# Altium schematic sheet band.SchDoc: Band
size A3; SheetNumber: 1; SheetTotal: 1
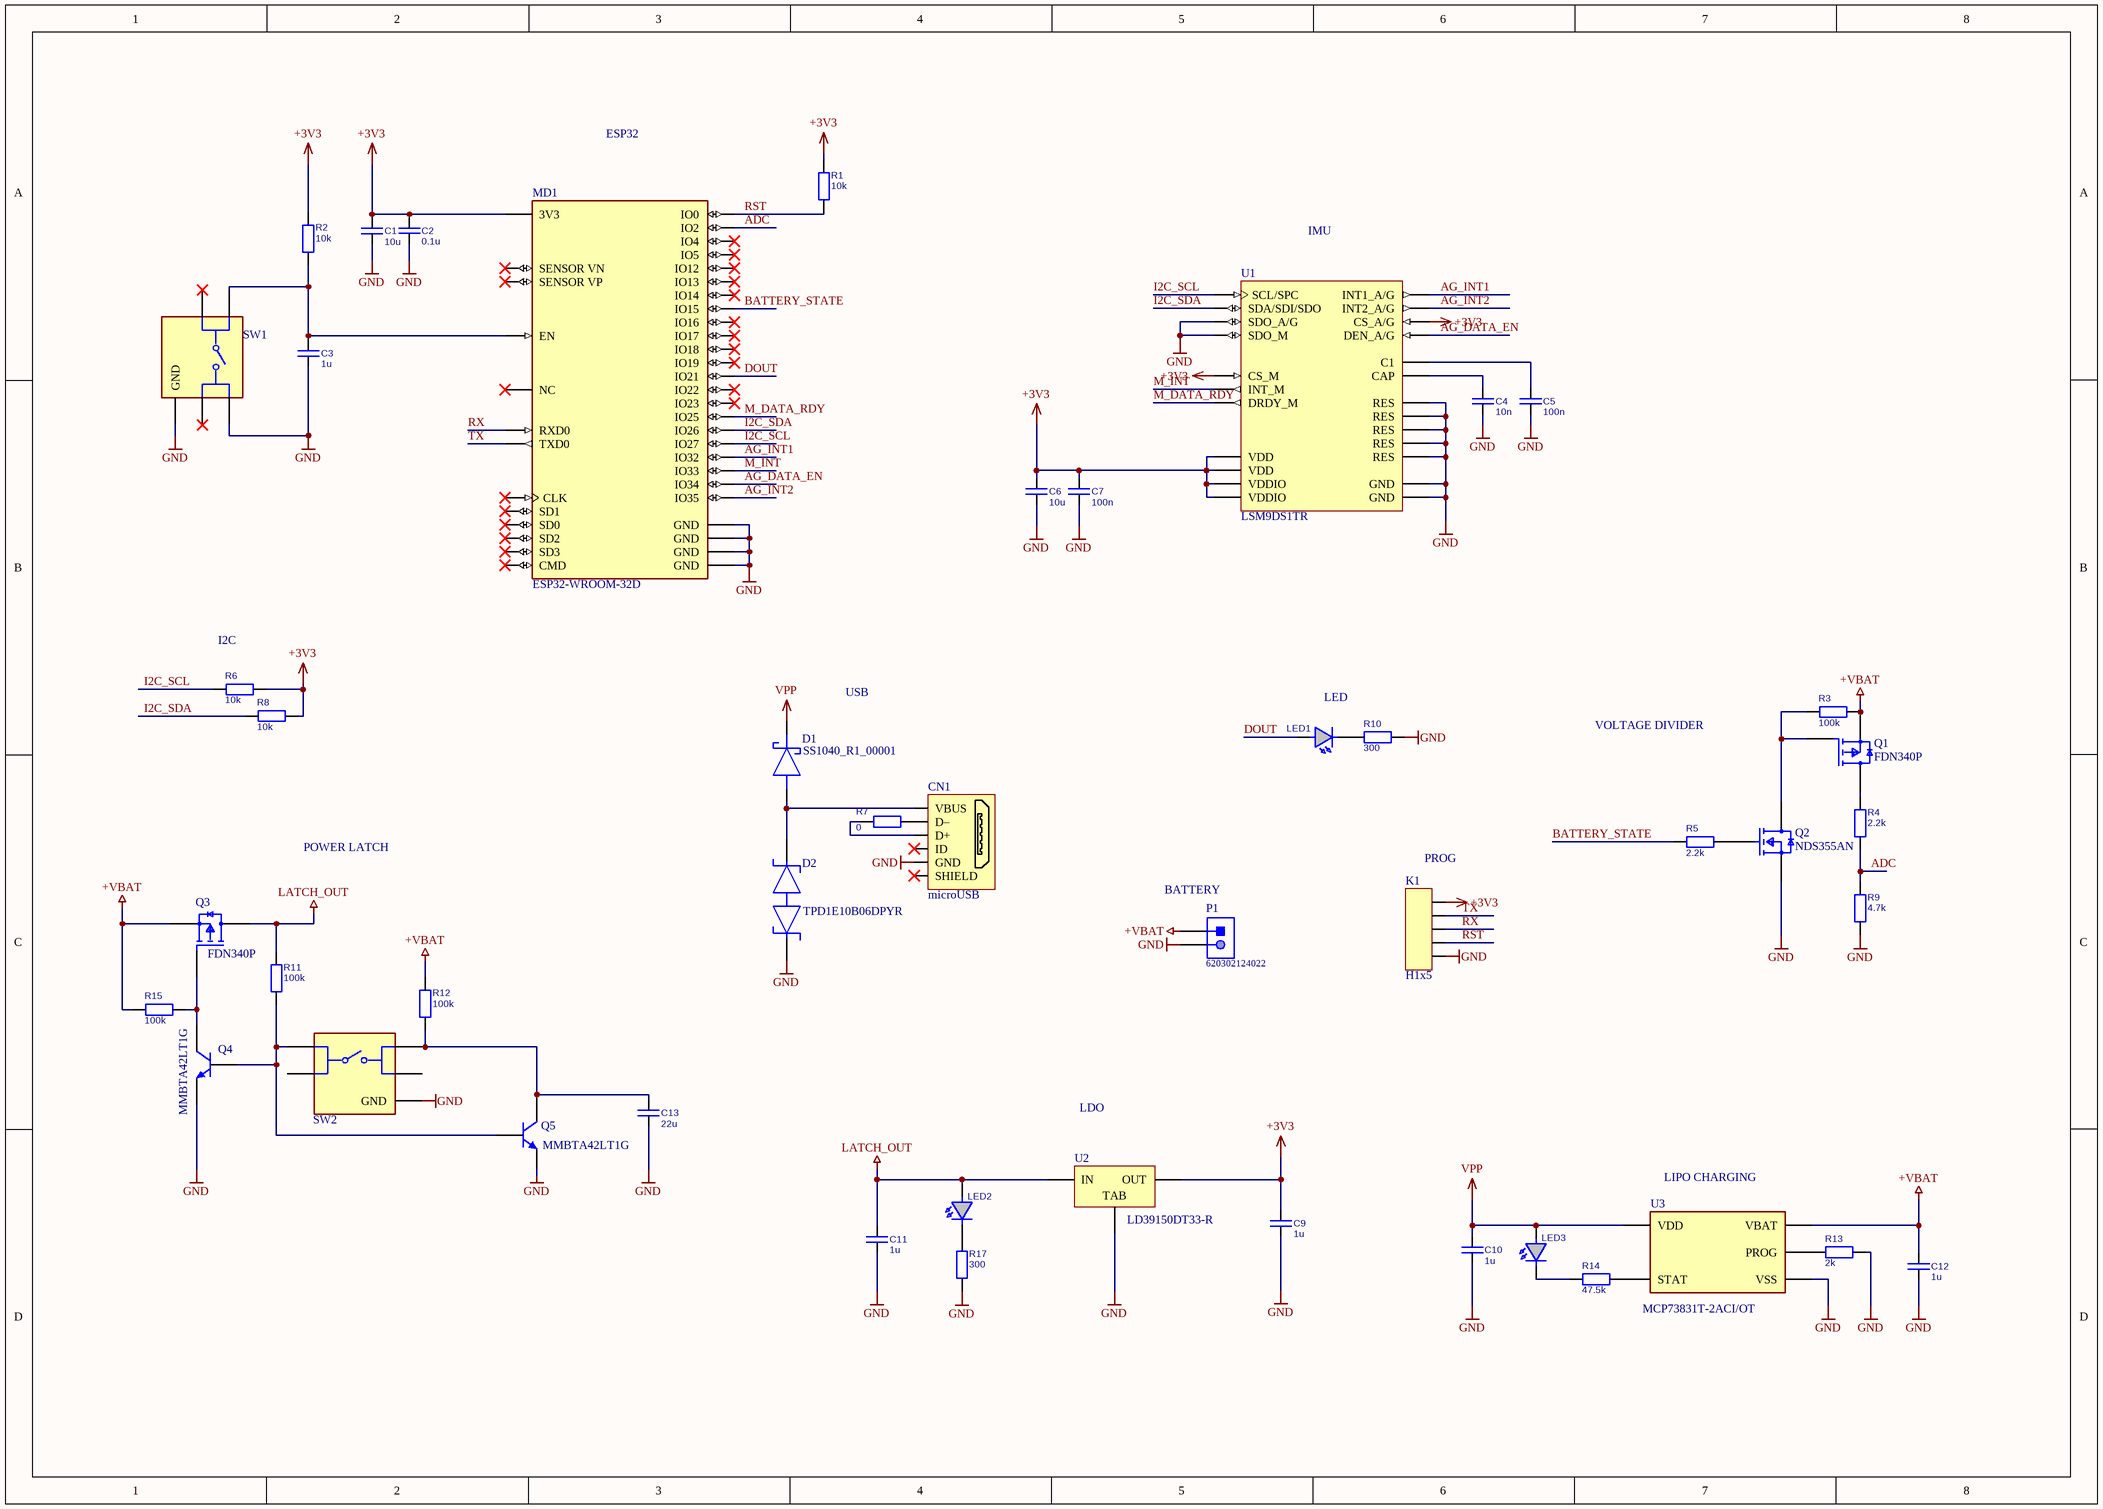
[diagram p0: band.SchDoc]

## Parts
C1  10u  [C0805]
C2  0.1u  [C0805]
C3  1u  [C0805]
C4  10n  [C0805]
C5  100n  [C0805]
C6  10u  [C0805]
C7  100n  [C0805]
C9  1u  [C0805]
C10  1u  [C0805]
C11  1u  [C0805]
C12  1u  [C0805]
C13  22u  [C0805]
CN1  microUSB  [micro-USB-HRS-ZX62D-B-5PA8]
D1  SS1040_R1_00001  [SS1040_R1_00001]
D2  TPD1E10B06DPYR  [FP-DPY0002A-MFG]
K1  H1x5  [H1x5]
LED1  LED  [LED0805G]  (value not drawn)
LED2  LED  [LED0805G]  (value not drawn)
LED3  LED  [LED0805G]  (value not drawn)
MD1  ESP32-WROOM-32D  [FP-ESP32-WROOM-32D-MFG]
P1  620302124022  [620302124022]
Q1  FDN340P  [FP-527AG-MFG]
Q2  NDS355AN  [FP-527AG-01-IPC_C]
Q3  FDN340P  [FP-527AG-MFG]
Q4  MMBTA42LT1G  [ONSC-SOT-23-3-318-08_V]
Q5  MMBTA42LT1G  [ONSC-SOT-23-3-318-08_V]
R1  10k  [R0805]
R2  10k  [R0805]
R3  100k  [R0805]
R4  2.2k  [R0805]
R5  2.2k  [R0805]
R6  10k  [R0805]
R7  0  [R0805]
R8  10k  [R0805]
R9  4.7k  [R0805]
R10  300  [R0805]
R11  100k  [R0805]
R12  100k  [R0805]
R13  2k  [R0805]
R14  47.5k  [R0805]
R15  100k  [R0805]
R17  300  [R0805]
SW1  FSM1LP  [FP-FSM1LP-MFG]  (value not drawn)
SW2  FSM1LP  [FP-FSM1LP-MFG]  (value not drawn)
U1  LSM9DS1TR  [STM-LGA-24_3500X3000X1000]
U2  LD39150DT33-R  [TO-252_M]
U3  MCP73831T-2ACI/OT  [FP-C04-091-OT-IPC_B]

## Nets
+3V3: C1.1 C2.1 C6.1 C7.1 C9.1 K1.1 MD1.2(3V3) R1.1 R2.2 R6.2 R8.2 U1.1(VDDIO) U1.3(VDDIO) U1.7(CS_A/G) U1.8(CS_M) U1.22(VDD) U1.23(VDD) U2.3(OUT)
+VBAT: C12.1 P1.1 Q1.2(S) Q3.2(S) R3.1 R12.2 R15.2 U3.3(VBAT)
GND: C1.2 C2.2 C3.2 C4.2 C5.2 C6.2 C7.2 C9.2 C10.2 C11.1 C12.2 C13.1 CN1.5(GND) D2.1 K1.5 MD1.1(GND) MD1.15(GND) MD1.38(GND) MD1.39(GND) P1.2 Q2.2(S) Q4.2(E) Q5.2(E) R9.1 R10.2 R13.1 R17.1 SW1.3 SW1.5(GND) SW2.5(GND) U1.5(SDO_A/G) U1.6(SDO_M) U1.14(RES) U1.15(RES) U1.16(RES) U1.17(RES) U1.18(RES) U1.19(GND) U1.20(GND) U2.4(TAB) U3.2(VSS)
LATCH_OUT: C11.2 LED2.A Q3.3(D) R11.2 U2.1(IN)
VPP: C10.1 D1.1(K) LED3.A U3.4(VDD)
ADC: MD1.24(IO2) R4.2 R9.2
AG_DATA_EN: MD1.6(IO34) U1.13(DEN_A/G)
AG_INT1: MD1.8(IO32) U1.11(INT1_A/G)
AG_INT2: MD1.7(IO35) U1.12(INT2_A/G)
BATTERY_STATE: MD1.23(IO15) R5.1
DOUT: LED1.A MD1.33(IO21)
I2C_SCL: MD1.12(IO27) R6.1 U1.2(SCL/SPC)
I2C_SDA: MD1.11(IO26) R8.1 U1.4(SDA/SDI/SDO)
M_DATA_RDY: MD1.10(IO25) U1.9(DRDY_M)
M_INT: MD1.9(IO33) U1.10(INT_M)
RST: K1.4 MD1.25(IO0) R1.2
RX: K1.3 MD1.34(RXD0)
TX: K1.2 MD1.35(TXD0)
NetC3_1: C3.1 MD1.3(EN) R2.1 SW1.1
NetC4_1: C4.1 U1.21(CAP)
NetC5_1: C5.1 U1.24(C1)
NetC13_2: C13.2 Q5.3(C) R12.1 SW2.3
NetCN1_1: CN1.1(VBUS) D1.2(A) D2.2
NetCN1_2: CN1.2(D–) R7.1
NetCN1_3: CN1.3(D+) R7.2
NetLED1_K: LED1.K R10.1
NetLED2_K: LED2.K R17.2
NetLED3_K: LED3.K R14.2
NetQ1_1: Q1.1(G) Q2.3(D) R3.2
NetQ1_3: Q1.3(D) R4.1
NetQ2_1: Q2.1(G) R5.2
NetQ3_1: Q3.1(G) Q4.3(C) R15.1
NetQ4_1: Q4.1(B) Q5.1(B) R11.1 SW2.1
NetR13_2: R13.2 U3.5(PROG)
NetR14_1: R14.1 U3.1(STAT)

Not connected (* = marked no-connect by the designer): CN1 4(ID)* 6(SHIELD)*; MD1 4(SENSOR_VP)* 5(SENSOR_VN)* 13(IO14)* 14(IO12)* 16(IO13)* 17(SD2)* 18(SD3)* 19(CMD)* 20(CLK)* 21(SD0)* 22(SD1)* 26(IO4)* 27(IO16)* 28(IO17)* 29(IO5)* 30(IO18)* 31(IO19)* 32(NC)* 36(IO22)* 37(IO23)*; SW1 2* 4*; SW2 2 4

## Notes on the sheet
- ESP32
- IMU
- (near R6) I2C
- USB
- LED
- VOLTAGE DIVIDER
- POWER LATCH
- (near P1) BATTERY
- (near K1) PROG
- LDO
- (near U3) LIPO CHARGING

## Library data of the parts
C1-C7 C9-C13 = C: Capacitor
  C1 C6: Value: 10u
  C2: Value: 0.1u
  C3 C9-C12: Value: 1u
  C4: Value: 10n
  C5 C7: Value: 100n
  C13: Value: 22u
CN1 = microUSB-B-socket (HIROSE ZX62D-B-5PA8): micro USB-B socket (HIROSE ZX62D-B-5PA8); pin to pad: 6>0; Supplier 1: Farnell; ComponentLink1URL: http://www.farnell.com/datasheets/1693470.pdf; ComponentLink1Description: http://www.farnell.com/datasheets/1693470.pdf; Supplier Part Number 1: 2300438
D1 = SS1040_R1_00001: Schottky Diode; Manufacturer_Name: PANJIT; Height: 1.35mm; Manufacturer_Part_Number: SS1040_R1_00001
D2 = CMP-0326-00004-4: TVS DIODE 5.5V 14V 2X1SON; Leakage Current: 100nA; Min Breakdown Voltage: 6V; Number of Channels: 1; ESD Protection: Yes; Power Line Protection: No; Test Current: 1mA; Interface: GPIO; Element Configuration: Single; Peak Pulse Current: 5A; Direction: Bidirectional; Peak Pulse Power: 90W; Capacitance: 12pF; Composition: Zener; Packaging: Tape and Reel; Number of Pins: 2; Breakdown Voltage: 6V; Radiation Hardening: No; Min Operating Temperature: -40°C; Contact Plating: Gold; Lead Free: Lead Free; Height: 0.35mm; REACH SVHC: No SVHC; Case/Package: 0402; Max Operating Temperature: 125°C; Width: 0.7mm; Clamping Voltage: 14V; Package Quantity: 1; Max Reverse Leakage Current: 100nA; Working Voltage: 5.5V; Length: 1.1mm; Number of Bidirectional Channels: 1; Reverse Standoff Voltage: 5.5V
K1 = H1x5: Header 1x5 (male)
LED1-LED3 = LED: pin to pad: A>1 K>2; Value: {Value}
MD1 = CMP-194065-000003-1: WIFI MODULE 32MBITS SPI FLASH; Manufacturer: Espressif Systems; Max Supply Voltage: 3.6V; Nominal Supply Current: 500mA; Max Frequency: 2484MHz; Number Of Adc Channels: 16; Number Of Gpio: 32; Interface: I2C,SPI,UART,Ethernet,I2S,Other; Data Rate: 150Mbits/s; Min Supply Voltage: 3V; Bandwidth: 72MHz; Sensitivity: -98dBm; Octopart: https://octopart.com/esp32-wroom-32d-espressif+systems-91040050; Package: ESP32-WROOM-32D; ComponentLink2URL: https://www.espressif.com/sites/default/files/documentation/esp32-wroom-32d_esp32-wroom-32u_datasheet_en.pdf; Lead Free: Yes; Category: UNK; Mouser Description: Wi-Fi/BT BLE Module ESP32-D0WD, SPI Flash, UART, P; Device Class L1: Integrated Circuits (ICs); RoHS: TRUE; Temperature Range Low: -40°C; ComponentLink2Description: Datasheet; Digikey Description: WIFI MODULE 32MBITS SPI FLASH; Height: 3.2mm; Temperature: -40°C to +85°C; Manufacturer Part Number: ESP32-WROOM-32D; Device Class L3: Transceivers; Device Class L2: RF Semiconductors and Devices; Temperature Range High: +85°C; Automotive: No
P1 = CMP-1502-00660-1: Male Shrouded Header WR-WTB, SMT, Vertical, pitch 2 mm, 1 x 2 position; Manufacturer: Wurth Elektronik; Pitch: 2mm; Position: 1x2; Working Voltage: 100VAC; Contact Resistance: 20mOhm; Package Reference: 620302124022; Manufacturer URL: http://www.we-online.de; Gender: Male; Orientation: Vertical; Publisher: WurthElektronik; Mounting Technology: SMT; Operating Temperature: -25to85degC; Datasheet URL: https://katalog.we-online.de/em/datasheet/6203xx124022.pdf; Packaging: TapeandReel; Part Number: 620302124022
Q1 Q3 = CMP-2100-03638-2: MOSFET P-CH 20V 2A SSOT3; Fall Time: 11ns; Rise Time: 9ns; Voltage Rating (DC): -20V; Power Dissipation: 500mW; Nominal Vgs: -800mV; Current Rating: -2A; Gate to Source Voltage (Vgs): 8V; Rds On Max: 70mR; Turn-Off Delay Time: 27ns; Element Configuration: Single; Number of Elements: 1; Input Capacitance: 779pF; Drain to Source Resistance: 60mR; Turn-On Delay Time: 10ns; Package Quantity: 1; Mount: Surface Mount; Case/Package: SOT-23; Min Operating Temperature: -55°C; REACH SVHC: No SVHC; Weight: 0.03g; Packaging: Tape and Reel; Threshold Voltage: -800mV; Max Operating Temperature: 150°C; Dual Supply Voltage: -20V; Termination: SMD/SMT; Drain to Source Voltage (Vdss): 20V; Height: 0.94mm; Length: 2.92mm; Contact Plating: Tin; Width: 3.05mm; Drain to Source Breakdown Voltage: -20V; Max Power Dissipation: 500mW; Continuous Drain Current (ID): 2A; Number of Pins: 3; Lead Free: Lead Free; Radiation Hardening: No; On-State Resistance: 70MR
Q2 = CMP-2000-06834-2: MOSFET N-CH 30V 1.7A SSOT3; Manufacturer: ON Semiconductor; Gate To Source Voltage: 20V; Threshold Vgs Min: 1V; Pulse Drain Current: 10A; Number Of N Channels: 1; Typ Forward Diode Voltage: 0.8V; Input Capacitace At Vds: 195pF @ 15V; Turn Off Delay Time: 13ns; Gate Charge At Vgs: 3.5nC @ 5V; Rthja Max: 250°C/W; Standoff Height: 0.013mm; Max Forward Diode Voltage: 1.2V; Power Dissipation: 0.46W; Depletion Mode: False; Threshold Vgs Max: 2V; Drain To Source Resistance: 0.105Ω; Turn On Delay Time: 10ns; Max Junction Temp: +150°C; Transconductance: 3.5S; Automotive: No; Drain To Source Voltage: 30V; Temperature: -55°C to +150°C; Device Class L1: Discrete Semiconductors; Number Of Channels: 1; Octopart: https://octopart.com/nds355an-on+semiconductor-84330922; Temperature Range High: +150°C; Category: Trans; Manufacturer Part Number: NDS355AN; Device Class L2: Transistors; RoHS: TRUE; Digikey Description: MOSFET N-CH 30V 1.7A SSOT3; Drain To Source Breakdown Voltage: 30V; Height: 1.22mm; Mouser Description: MOSFET SOT-23 N-CH LOGIC; Temperature Range Low: -55°C; ComponentLink2URL: https://www.onsemi.com/pub/Collateral/NDS355AN-D.PDF; ComponentLink2Description: Datasheet; Continuous Drain Current: 1.7A; Package: 527AG-01; Device Class L3: MOSFETs; Lead Free: Yes; Footprint Url: https://www.onsemi.com/pub/Collateral/527AG.PDF
Q4 Q5 = CMP-1048-00662-1: High Voltage Transistor, NPN Silicon, 3-Pin SOT-23, Pb-Free, Tape and Reel; Manufacturer: On Semiconductor; fT Min (MHz): 50; IC Continuous (A): 0.5; ComponentLink1URL: http://www.onsemi.com/; ComponentLink3URL: http://www.onsemi.cn/pub_link/Collateral/318-08.PDF; RoHS: TRUE; ComponentLink2Description: Datasheet; PartNumber: MMBTA42LT1G; Polarity: NPN; DatasheetVersion: Rev. 12; PackageReference: SOT-23-3-318-08; PackageDescription: 3-Pin Small Outline Transistor, Body 2.92 x 1.3 mm, Pitch 0.95 mm; ComponentLink3Description: Package Specification; ComponentLink1Description: Manufacturer URL; Packing: Tape and Reel; PackageVersion: Rev. AP, 11/2009; Mounting Technology: Surface Mount; ComponentLink2URL: http://www.onsemi.cn/pub_link/Collateral/MMBTA42LT1-D.PDF
R1-R15 R17 = R
  R1 R2 R6 R8: Value: 10k
  R3 R11 R12 R15: Value: 100k
  R4 R5: Value: 2.2k
  R7: Value: 0
  R9: Value: 4.7k
  R10 R17: Value: 300
  R13: Value: 2k
  R14: Value: 47.5k
SW1 SW2 = CMP-03402-000015-1: SWITCH TACTILE SPST-NO 0.05A 24V; Electrical Life: 100000Cycles; Actuator Type: Standard; Contact Resistance: 100mR; Current Rating: 50mA; Operating Force: 1.57N; Actuator Material: Polyphthalamide; Illumination Type: Non-Illuminated; Actuator Length: 0.01inch; Voltage Rating (DC): 12V; Throw Configuration: SPST; Switch Travel: 0.25mm; Switch Function: Off-Mom; Actuator Color: Black; Length: 6.19mm; Min Operating Temperature: -35°C; Contact Material: Copper Alloy; Max Current Rating: 50mA; Max Operating Temperature: 85°C; Packaging: Loose Piece; Lead Free: Lead Free; Mount: Surface Mount; RoHS Compliant: Yes; Orientation: Straight; Package Quantity: 2000; Mechanical Life: 100000Cycles; Type: Switch; ELV: Compliant; Depth: 8mm; Contact Plating: Silver; Max Voltage Rating (DC): 12V; REACH SVHC: No SVHC; Series: FSM1LP; Contact Current Rating: 50mA; Termination: Gull Wing
U1 = CMP-2000-06606-1: iNEMO Inertial Module: 3D Accelerometer, 3D Gyroscope, 3D Magnetometer, 1.9 to 3.6 V, -40 to 85 degC, 24-Pin LGA, RoHS, Tape and Reel; Manufacturer: STMicroelectronics; SVHC: NoSVHC(17-Dec-2015); MEMS Module Function: Tri-AxisGyroscope,Tri-AxisAccelerometer,Tri-AxisMagnetometer; Supply Voltage Max: 3.6V; No. of Pins: 24Pins; Gyroscope Range: ±245°/s,±500°/s,±2000°/s; Acceleration Range: ±2g,±4g,±8g,±16g; Supply Voltage Min: 1.9V; Package Description: 24-Pin Plastic Land Grid Array Package, Body 3.65 x 3.15 mm, Pitch 0.43 mm; Manufacturer URL: http://www.st.com/; PartNumber: LSM9DS1; Product Range: -; Packaging: CutTape; Sensor Case Style: LGA; Datasheet URL: http://www2.st.com/content/ccc/resource/technical/document/datasheet/1e/3f/2a/d6/25/eb/48/46/DM00103319.pdf/files/DM00103319.pdf/jcr:content/translations/en.DM00103319.pdf; Package Reference: LGA-24_3500X3000X1000; Mounting Technology: SurfaceMount; Datasheet Version: Rev. 3, 03/2015; MSL: MSL3-168hours
U2 = CMP-0244-00082-1: Ultra Low Drop BICMOS Voltage Regulator, 3.3V, 3-Pin DPAK, Tape and Reel; ComponentLink2URL: http://www.st.com/internet/com/TECHNICAL_RESOURCES/TECHNICAL_LITERATURE/DATASHEET/CD00150601.pdf; PackageReference: TO-252; ComponentLink2Description: Datasheet; PackageVersion: 2011; PackageDescription: 3-Pin Transistor Outline Package 2.28 mm Pitch, 9.7 mm Lead Span (DPAK); ComponentLink1Description: Manufacturer URL; ComponentLink1URL: http://www.st.com; DatasheetVersion: 1/01/2009
U3 = CMP-0133-00143-2: IC CONTROLLR LI-ION 4.2V SOT23-5; Max Power Dissipation: 1.54W; Output Current: 500mA; Max Output Voltage: 4.5V; Number of Outputs: 1; Min Output Voltage: 4.168V; Min Supply Voltage: 3.75V; Max Input Voltage: 6V; Voltage Rating: 4.534V; Drain to Source Resistance: 350mR; Max Operating Temperature: 85°C; Length: 0.122inch; Number of Pins: 5; REACH SVHC: No SVHC; Radiation Hardening: No; Min Operating Temperature: -40°C; Weight: 0.00709oz; Contact Plating: Tin; Termination: SMD/SMT; Case/Package: SOT-23; Mount: Surface Mount; Width: 0.071inch; Packaging: Tape and Reel; Number of Cells: 1; Max Charge Current: 500mA; Height: 0.051inch; Number of Channels: 1; Output Voltage: 4.2V; Max Supply Voltage: 6V; Lead Free: Lead Free